# EAGLE design FubarinoMini_v16 (EAGLE 6.4)
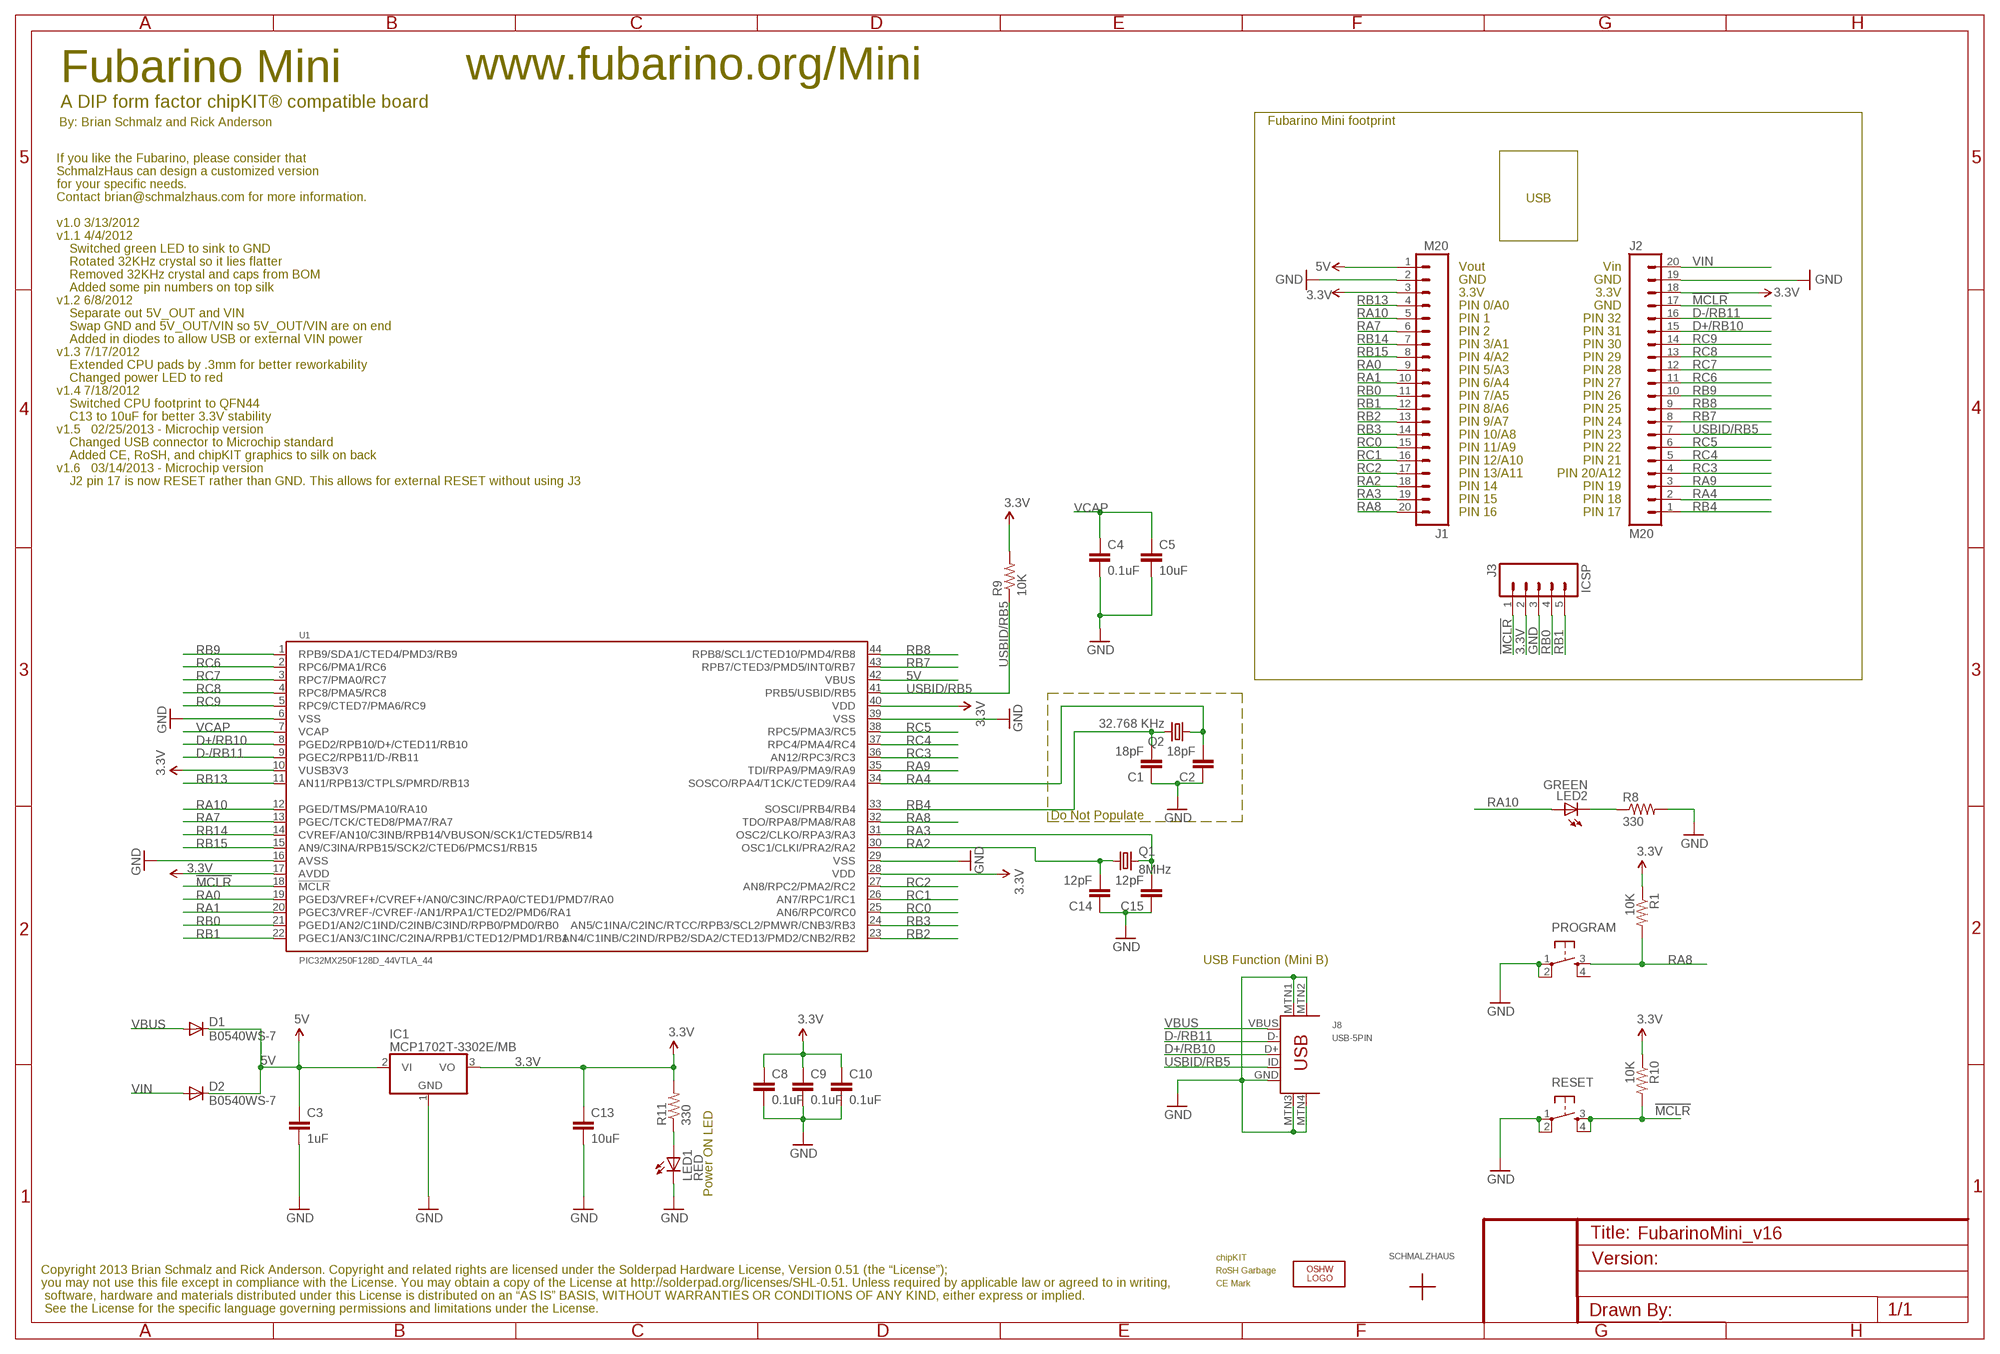
[diagram p0: schematic, sheet 1]

## Parts
C1  18pF  CAP0603-CAP  [0603-CAP]
C2  18pF  CAP0603-CAP  [0603-CAP]
C3  1uF  CAP0603-CAP  [0603-CAP]
C4  0.1uF  CAP0603-CAP  [0603-CAP]
C5  10uF  CAP0805  [0805]
C8  0.1uF  CAP0603-CAP  [0603-CAP]
C9  0.1uF  CAP0603-CAP  [0603-CAP]
C10  0.1uF  CAP0603  [0603]
C13  10uF  CAP0805  [0805]
C14  12pF  CAP0603-CAP  [0603-CAP]
C15  12pF  CAP0603-CAP  [0603-CAP]
D1  B0540WS-7  DIODESOD  [SOD-323]
D2  B0540WS-7  DIODESOD  [SOD-323]
IC1  MCP1702T-3302E/MB  MCP170333MB  [SOT89]
ICSP  J3  M05NOSLILK  [1X05_NOSILK]
J1  M20  [1X20_NO_PIN1]
J2  M20  [1X20_NO_PIN1]
J8  USB-5PIN  [USB-MINIB-5PIN-HIROSE-UX60-MB-5ST]
LED1  RED  LED0603  [LED-0603]
LED2  GREEN  LED0603  [LED-0603]
LOGO1  OSHW_LOGO_8MILX0070-NT  [OSHW_8X70_NOTEXT]
PROGRAM  TAC_SWITCHSND  [TACTILE_SWITCH_SMD]
Q1  8MHz  CRYSTALNX5032  [NX5032_5MM_3.2MM_CRYSTAL]
Q2  32.768 KHz  CRYSTALTC26H  [TC26H]
R1  10K  RESISTOR0603-RES  [0603-RES]
R8  330  RESISTOR0603-RES  [0603-RES]
R9  10K  RESISTOR0603-RES  [0603-RES]
R10  10K  RESISTOR0603-RES  [0603-RES]
R11  330  RESISTOR0603-RES  [0603-RES]
RESET  TAC_SWITCHSND  [TACTILE_SWITCH_SMD]
U1  PIC32MX250F128D_44VTLA_44  PIC32MX2XX_44QFN44  [QFN-44-8X8-NOPAD]
U$1  SCHMALZHAUSSCHMALZHAUS_SMALL  [SCHMALZHAUS_SMALL]
U$2  CE_MARK5MM  [CE_5MM]
U$3  ROSH_GARBAGE  [ROHS_GARBAGE_5MM]
U$4  CHIPKIT2MM  [CHIPKIT_2MM]

## Nets
3.3V: C8.1 C9.1 C10.1 C13.1 IC1.3(VO) ICSP.2 J1.3 J2.18 R1.1 R9.2 R10.1 R11.2 U1.10(VUSB3V3) U1.17(AVDD) U1.28(VDD) U1.40(VDD)
5V: C3.1 D1.1(C) D2.1(C) IC1.2(VI) IC1.2@1(VI1) J1.1 U1.42(VBUS)
!MCLR!: ICSP.1 J2.17 R10.2 RESET.3 RESET.4 U1.18(!MCLR!)
D+/RB10: J2.15 J8.D+ U1.8(PGED2/RPB10/D+/CTED11/RB10)
D-/RB11: J2.16 J8.D- U1.9(PGEC2/RPB11/D-/RB11)
GND: C1.1 C2.1 C3.2 C4.2 C5.2 C8.2 C9.2 C10.2 C13.2 C14.1 C15.1 IC1.1(GND) ICSP.3 J1.2 J2.19 J8.GND J8.MTN1 J8.MTN2 J8.MTN3 J8.MTN4 LED1.C PROGRAM.1 PROGRAM.2 R8.2 RESET.1 RESET.2 U1.6(VSS) U1.16(AVSS) U1.29(VSS) U1.39(VSS)
N$6: LED1.A R11.1
N$20: LED2.C R8.1
RA0: J1.9 U1.19(PGED3/VREF+/CVREF+/AN0/C3INC/RPA0/CTED1/PMD7/RA0)
RA1: J1.10 U1.20(PGEC3/VREF-/CVREF-/AN1/RPA1/CTED2/PMD6/RA1)
RA2: C14.2 J1.18 Q1.1 U1.30(OSC1/CLKI/PRA2/RA2)
RA3: C15.2 J1.19 Q1.2 U1.31(OSC2/CLKO/RPA3/RA3)
RA4: C2.2 J2.2 Q2.1 U1.34(SOSCO/RPA4/T1CK/CTED9/RA4)
RA7: J1.6 U1.13(PGEC/TCK/CTED8/PMA7/RA7)
RA8: J1.20 PROGRAM.3 R1.2 U1.32(TDO/RPA8/PMA8/RA8)
RA9: J2.3 U1.35(TDI/RPA9/PMA9/RA9)
RA10: J1.5 LED2.A U1.12(PGED/TMS/PMA10/RA10)
RB0: ICSP.4 J1.11 U1.21(PGED1/AN2/C1IND/C2INB/C3IND/RPB0/PMD0/RB0)
RB1: ICSP.5 J1.12 U1.22(PGEC1/AN3/C1INC/C2INA/RPB1/CTED12/PMD1/RB1)
RB2: J1.13 U1.23(AN4/C1INB/C2IND/RPB2/SDA2/CTED13/PMD2/CNB2/RB2)
RB3: J1.14 U1.24(AN5/C1INA/C2INC/RTCC/RPB3/SCL2/PMWR/CNB3/RB3)
RB4: C1.2 J2.1 Q2.2 U1.33(SOSCI/PRB4/RB4)
RB7: J2.8 U1.43(RPB7/CTED3/PMD5/INT0/RB7)
RB8: J2.9 U1.44(RPB8/SCL1/CTED10/PMD4/RB8)
RB9: J2.10 U1.1(RPB9/SDA1/CTED4/PMD3/RB9)
RB13: J1.4 U1.11(AN11/RPB13/CTPLS/PMRD/RB13)
RB14: J1.7 U1.14(CVREF/AN10/C3INB/RPB14/VBUSON/SCK1/CTED5/RB14)
RB15: J1.8 U1.15(AN9/C3INA/RPB15/SCK2/CTED6/PMCS1/RB15)
RC0: J1.15 U1.25(AN6/RPC0/RC0)
RC1: J1.16 U1.26(AN7/RPC1/RC1)
RC2: J1.17 U1.27(AN8/RPC2/PMA2/RC2)
RC3: J2.4 U1.36(AN12/RPC3/RC3)
RC4: J2.5 U1.37(RPC4/PMA4/RC4)
RC5: J2.6 U1.38(RPC5/PMA3/RC5)
RC6: J2.11 U1.2(RPC6/PMA1/RC6)
RC7: J2.12 U1.3(RPC7/PMA0/RC7)
RC8: J2.13 U1.4(RPC8/PMA5/RC8)
RC9: J2.14 U1.5(RPC9/CTED7/PMA6/RC9)
USBID/RB5: J2.7 J8.ID R9.1 U1.41(PRB5/USBID/RB5)
VBUS: D1.2(A) J8.VBUS
VCAP: C4.1 C5.1 U1.7(VCAP)
VIN: D2.2(A) J2.20
Unconnected: PROGRAM.4

## Notes on the sheet
- Fubarino Mini | www.fubarino.org/Mini
- A DIP form factor chipKIT® compatible board
- By: Brian Schmalz and Rick Anderson | Fubarino Mini footprint
- If you like the Fubarino, please consider that
- SchmalzHaus can design a customized version
- for your specific needs.
- Contact brian@schmalzhaus.com for more information. | USB
- v1.0 3/13/2012
- v1.1 4/4/2012
- Switched green LED to sink to GND
- Vin
- Rotated 32KHz crystal so it lies flatter
- Vout
- GND
- Removed 32KHz crystal and caps from BOM
- GND
- 3.3V
- Added some pin numbers on top silk
- 3.3V
- GND
- v1.2 6/8/2012
- PIN 0/A0
- PIN 32
- Separate out 5V_OUT and VIN
- PIN 1
- PIN 31
- Swap GND and 5V_OUT/VIN so 5V_OUT/VIN are on end
- PIN 2
- PIN 30
- Added in diodes to allow USB or external VIN power
- PIN 3/A1
- PIN 29
- v1.3 7/17/2012
- PIN 4/A2
- PIN 28
- Extended CPU pads by .3mm for better reworkability
- PIN 5/A3
- PIN 27
- Changed power LED to red
- PIN 6/A4
- PIN 26
- v1.4 7/18/2012
- PIN 7/A5
- PIN 25
- Switched CPU footprint to QFN44
- PIN 8/A6
- PIN 24
- C13 to 10uF for better 3.3V stability
- PIN 9/A7
- PIN 23
- v1.5   02/25/2013 - Microchip version
- PIN 10/A8
- PIN 22
- Changed USB connector to Microchip standard
- PIN 11/A9
- PIN 21
- Added CE, RoSH, and chipKIT graphics to silk on back
- PIN 12/A10
- PIN 20/A12
- v1.6   03/14/2013 - Microchip version
- PIN 13/A11
- PIN 19
- J2 pin 17 is now RESET rather than GND. This allows for external RESET without using J3
- PIN 14
- PIN 18
- PIN 15
- PIN 17
- PIN 16
- Do Not Populate
- USB Function (Mini B)
- Power ON LED
- Copyright 2013 Brian Schmalz and Rick Anderson. Copyright and related rights are licensed under the Solderpad Hardware License, Version 0.51 (the “License”);
- you may not use this file except in compliance with the License. You may obtain a copy of the License at http://solderpad.org/licenses/SHL-0.51. Unless required by applicable law or agreed to in writing,
- software, hardware and materials distributed under this License is distributed on an “AS IS” BASIS, WITHOUT WARRANTIES OR CONDITIONS OF ANY KIND, either express or implied.
- See the License for the specific language governing permissions and limitations under the License.

## Library data of the parts
C1-C4 C8 C9 C14 C15 = SparkFun:CAP: Capacitor Standard 0603 ceramic capacitor, and 0.1" leaded capacitor.
C5 = SchmalzHaus:CAP: Capacitor Standard 0603 ceramic capacitor, and 0.1" leaded capacitor.
C10 C13 = SparkFun02-20-08:CAP: Capacitor Standard 0603 ceramic capacitor, and 0.1" leaded capacitor.
D1 D2 = SparkFun:DIODE: Diode These are standard reverse protection diodes and small signal diodes. SMA package can handle up to about 1A. SOD-323 can handle about 200mA. What the SOD-323 package when ordering, there are some mfgs out there that are 5-pin packages.
IC1 = linear:MCP1703*: 250 mA, 16V, Low Quiescent Current LDO Regulator Source: http://ww1.microchip.com/downloads/en/DeviceDoc/22049b.pdf
ICSP = SchmalzHaus:M05: Header 5 Standard 5-pin 0.1" header. Use with straight break away headers (SKU : PRT-00116), right angle break away headers (PRT-00553), swiss pins (PRT-00743), machine pins (PRT-00117), and female headers (PRT-00115). Molex polarized connector foot print use with SKU : PRT-08230 with associated crimp pins and housings.
J1 J2 = SchmalzHaus:M20
J8 = SchmalzHaus:USB-5PIN
LED1 LED2 = SparkFun:LED: LEDs Standard schematic elements and footprints for 5mm, 3mm, 1206, and 0603 sized LEDs. 5mm - Spark Fun Electronics SKU : COM-00529 (and others)
LOGO1 = OSHW:OSHW_LOGO_8MIL
PROGRAM RESET = SparkFun02-20-08:TAC_SWITCH: Momentary Switch Button commonly used for reset or general input. Spark Fun Electronics SKU : COM-00097
Q1 Q2 = SchmalzHaus:CRYSTAL: Crystals Various standard crystals. Proven footprints. Spark Fun Electronics SKU : COM-00534
R1 R8-R11 = SparkFun:RESISTOR: Resistor Basic schematic elements and footprints for 0603, 1206, and PTH resistors.
U1 = SchmalzHaus:PIC32MX2XX_44
U$1 = SchmalzHaus:SCHMALZHAUS
U$2 = SchmalzHausPublic:CE_MARK
U$3 = SchmalzHausPublic:ROSH_GARBAGE
U$4 = SchmalzHausPublic:CHIPKIT

## Board
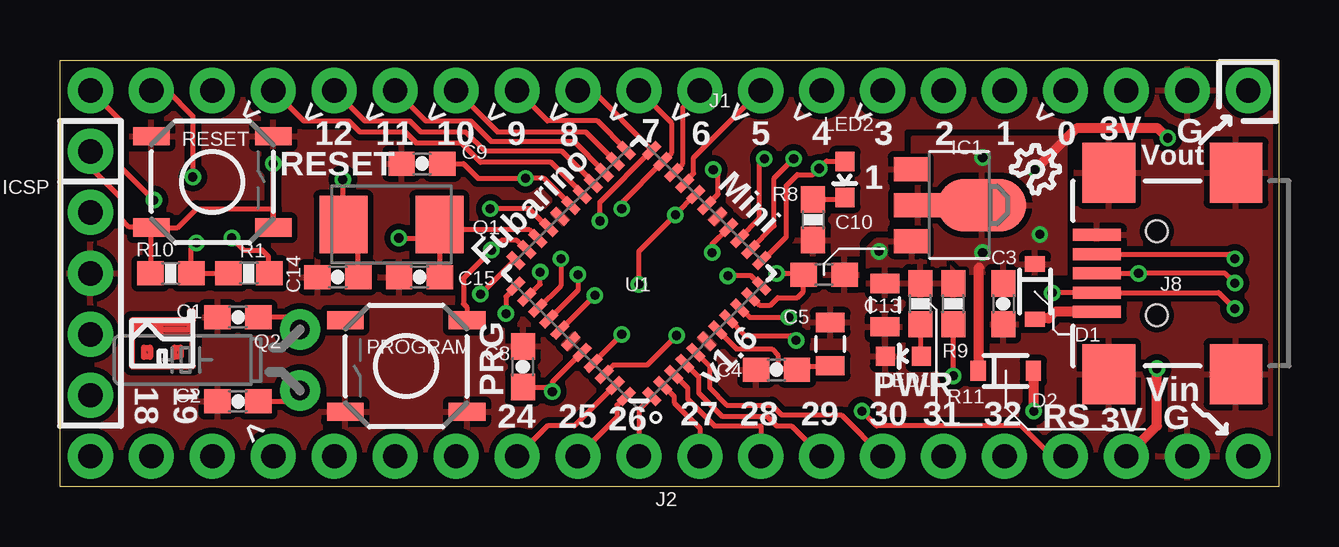
[diagram p1: board, top side]
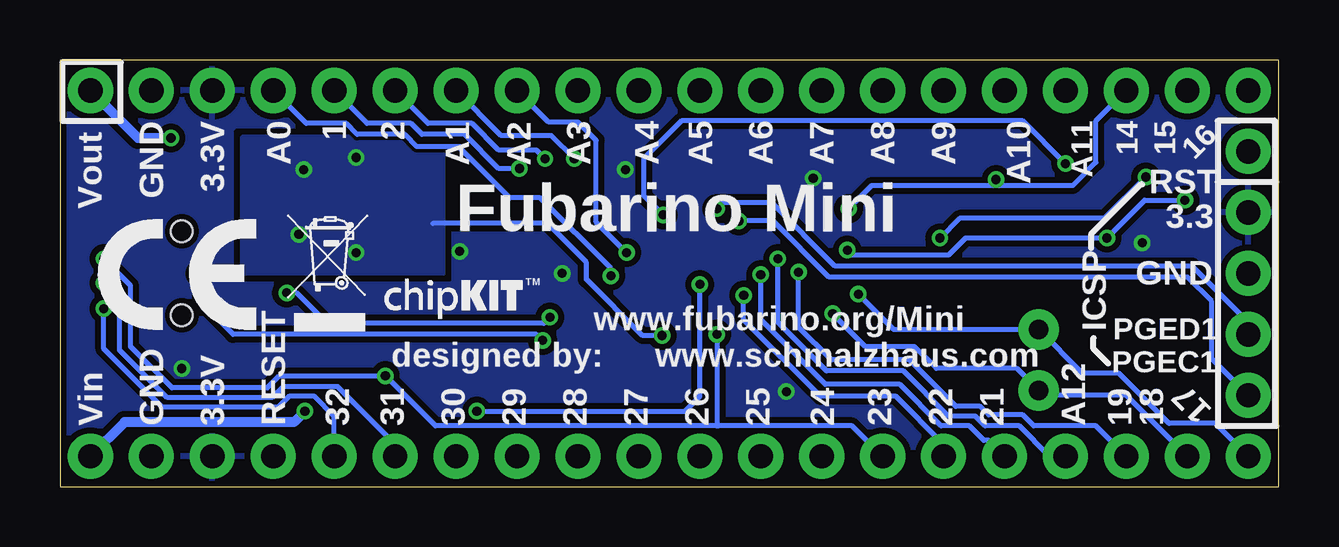
[diagram p2: board, bottom side, seen from below]

Size 50.8 x 17.78 mm. Coordinates in mm from the lower left corner, seen from the top.
Outline: 0,17.78 50.8,17.78 50.8,0 0,0 0,17.78
Copper layers (1*16): Top 0.035mm / dielectric 1.5mm / Bottom 0.035mm
Design rules "Fusion_eagle_rule_v1.1": minimum track width 6mil, minimum drill 12mil, track to track 6mil, track to pad 6mil, pad to pad 6mil, via to via 6mil, smd to smd 0mil, copper to edge 10mil, drill to drill 10mil, minimum pad ring 10mil, minimum via ring 6mil, stop-mask expansion 2mil, vias tented up to drill 100mil, thermal gap 10mil

### Footprints (pad centres in the part's own frame; a part is rotated, then mirrored left to right if it is on the bottom)
0603-CAP = smd 1.1 x 1: 1 -0.85,0; 2 0.85,0
0805 = smd 0.8 x 1.2: 1 -0.9,0; 2 0.9,0
0603 = smd 1.1 x 1: 1 -0.85,0; 2 0.85,0
SOD-323 = smd 0.63 x 0.83: 1 -1.15,0; 2 1.15,0
SOT89 = smd 1 x 1.5: 1 -1.499,-1.981; 3 1.499,-1.981 | smd 1 x 2: 2 0,-1.727 | smd 2.2 x 3.7: 2@1 0,0.94
1X05_NOSILK = drill 1.016 pad 1.88: 1 0,0; 2 2.54,0; 3 5.08,0; 4 7.62,0; 5 10.16,0
1X20_NO_PIN1 = drill 1.016 pad 1.88: 1 -24.13,0; 2 -21.59,0; 3 -19.05,0; 4 -16.51,0; 5 -13.97,0; 6 -11.43,0; 7 -8.89,0; 8 -6.35,0; 9 -3.81,0; 10 -1.27,0; 11 1.27,0; 12 3.81,0; 13 6.35,0; 14 8.89,0; 15 11.43,0; 16 13.97,0; 17 16.51,0; 18 19.05,0; 19 21.59,0; 20 24.13,0
USB-MINIB-5PIN-HIROSE-UX60-MB-5ST = smd 0.5 x 2: D+ 0,2.5; D- -0.8,2.5; GND 1.6,2.5; ID 0.8,2.5; VBUS -1.6,2.5 | smd 2.5 x 2.2: MTN1 -4.2,-3.3; MTN2 -4.2,2; MTN3 4.2,-3.3; MTN4 4.2,2 | hole 0.9: -1.75,0; 1.75,0
LED-0603 = smd 0.8 x 0.8: A 0,-0.75; C 0,0.75
TACTILE_SWITCH_SMD = smd 1.524 x 0.762: 1 -2.54,1.905; 2 2.54,1.905; 3 -2.54,-1.905; 4 2.54,-1.905
NX5032_5MM_3.2MM_CRYSTAL = smd 2 x 2.4: 1 -2,0; 2 2,0
TC26H = drill 0.813 pad 1.676: 1 -1.27,0; 2 1.27,0
0603-RES = smd 1.1 x 1: 1 -0.85,0; 2 0.85,0
QFN-44-8X8-NOPAD = smd 0.8 x 0.35: 1 -4,3.25; 2 -4,2.6; 3 -4,1.95; 4 -4,1.3; 5 -4,0.65; 6 -4,0; 7 -4,-0.65; 8 -4,-1.3; 9 -4,-1.95; 10 -4,-2.6; 11 -4,-3.25; 23 4,-3.25; 24 4,-2.6; 25 4,-1.95; 26 4,-1.3; 27 4,-0.65; 28 4,0; 29 4,0.65; 30 4,1.3; 31 4,1.95; 32 4,2.6; 33 4,3.25 | smd 0.35 x 0.8: 12 -3.25,-4; 13 -2.6,-4; 14 -1.95,-4; 15 -1.3,-4; 16 -0.65,-4; 17 0,-4; 18 0.65,-4; 19 1.3,-4; 20 1.95,-4; 21 2.6,-4; 22 3.25,-4; 34 3.25,4; 35 2.6,4; 36 1.95,4; 37 1.3,4; 38 0.65,4; 39 0,4; 40 -0.65,4; 41 -1.3,4; 42 -1.95,4; 43 -2.6,4; 44 -3.25,4

### Placement (x,y rotation side)
C1  7.42,7.06 0 top
C2  7.42,3.56 0 top
C3  39.32,7.62 270 top
C4  29.87,4.88 180 top
C5  32.11,5.94 90 top
C8  19.3,5 90 top
C9  15.09,13.46 180 top
C10  31.85,8.84 0 top
C13  34.39,7.57 270 top
C14  11.58,8.74 0 top
C15  14.99,8.74 0 top
D1  40.64,8.13 270 top
D2  39.42,4.83 0 top
DRILEGEND  [DRILEGEND]  101.19,28.7 0 top  (outside the outline)
IC1  37.49,11.73 270 top
ICSP  1.27,13.97 270 top
J1  25.4,16.51 180 top
J2  25.4,1.27 0 top
J8  45.72,8.89 90 top
LED1  35.15,5.44 90 top
LED2  32.72,12.8 180 top
LOGO1  39.41,13.38 315 top
PROGRAM  14.43,5.03 180 top
Q1  13.82,10.92 0 top
Q2  10.01,5.28 90 top
R1  7.87,8.89 0 top
R8  31.39,11.13 270 top
R9  37.24,7.62 90 top
R10  4.62,8.89 180 top
R11  35.86,7.62 90 top
RESET  6.35,12.7 0 top
U1  24.13,8.89 135 top
U$1  4.27,5.03 0 top
U$2  45.9,8.9 0 bottom
U$3  41.3,6.49 0 bottom
U$4  37.39,6.94 0 bottom

### Tracks (layer width: path | path; a pad name or v marks a point on that pad's centre or on a via)
3.3V  (via drill 0.38)
  Top 0.203: 5.44,8.85 R10.1 | R10.1 R1.1 | C9.1 16.82,13.46 17.42,12.85 v19.41,12.85 20.17,12.85 U1.28 | U1.10 28.83,7.9 29.16,7.57 29.62,7.57 29.92,7.87 30.73,7.87 30.99,8.13 30.99,8.83 C10.1 30.95,8.89 v29.87,8.89 | R10.1 5.47,9.94 v5.69,10.16 | U1.40 20.52,4.37 v20.52,3.96 20.34,4.15 C8.1 | U1.17 27.43,12.19 27.43,13.01 v27.23,13.21
  Top 0.406: J2.18 45.72,2.54 v45.72,4.93
  other vias: 34.14,9.8
  pour Bottom (isolate 0.254, rank 3): 0,0 0,17.78 50.8,17.78 50.8,0
  pour Top: 34.04,10.26 33.68,9.91 33.68,7.98 37.29,7.98 37.29,8.94 36.93,9.3 36.12,9.3 35.86,9.55 35.86,9.86 35.46,10.26
5V  (via drill 0.38)
  Top 0.203: U1.42 22.68,4.7 23.06,5.08 24.49,5.08 v25.7,6.3
  Top 0.406: 38.3,9.14 38.3,4.79 D2.1 | v46.18,14.53 45.77,14.94 42.37,14.94 v40.64,13.21
  Bottom 0.203: 35.26,10.97 30.48,10.97 28.85,9.35 28.85,8.64 26.52,6.3 v25.7,6.3
  Bottom 0.406: v46.18,14.53 47.55,14.53 J1.1
  other vias: 40.84,10.52 38.46,13.72 38.46,9.75
  pour Top (rank 3): 35.61,8.94 41.91,8.89 41.91,14.53 35.56,14.53
  pour Bottom: 34.85,14.58 34.85,8.89 43.18,8.89 43.18,14.58
!MCLR!  (via drill 0.38)
  Top 0.203: RESET.3 4.9,10.79 5.69,11.58 8.89,11.58 RESET.4 v8.89,13.46 | RESET.3 3.81,8.93 R10.2 | ICSP.1 1.27,13.31 2.54,12.04 2.54,11.18 2.9,10.82 3.79,10.82 RESET.3 | U1.18 v25.65,11.33 24.13,9.8 v24.13,8.43 | J2.17 41.35,1.27 40.08,2.54 34.04,2.54 v33.43,3.15
  Bottom 0.203: v8.89,13.46 10.67,15.24 24.89,15.24 26.47,13.66 26.47,12.14 v25.65,11.33 | v33.43,3.15 24.74,3.15 24.13,3.76 v24.13,8.43
D+/RB10  (via drill 0.38)
  Top 0.203: v48.97,8.48 48.56,8.89 v44.96,8.89 J8.D+ | U1.8 28.55,6.3 30.48,6.3 v30.68,6.1
  Bottom 0.203: J2.15 36.83,1.78 39.22,4.17 41.5,4.17 41.96,3.71 46.33,3.71 48.31,5.69 48.31,7.82 v48.97,8.48 | v30.68,6.1 30.94,6.35 43.59,6.35 44.96,7.72 v44.96,8.89
D-/RB11  (via drill 0.38)
  Top 0.203: U1.9 28.37,7.44 28.75,7.06 v30.38,7.06 | 48.72,7.67 v48.97,7.42 48.3,8.09 J8.D- 41.36,8.09 v41.35,8.08
  Bottom 0.203: J2.16 39.37,2.95 40.18,3.76 41.25,3.76 41.71,3.3 46.53,3.3 48.97,5.74 v48.97,7.42 | v30.38,7.06 30.63,6.81 39.67,6.81 40.95,8.08 v41.35,8.08
GND
  pour Top (isolate 0.254, rank 6): 0,17.78 0,0 50.8,0 50.8,17.78
N$6
  Top 0.203: R11.1 35.87,5.47 LED1.A
N$20
  Top 0.203: R8.1 32.64,11.97 LED2.C
RA0
  Top 0.203: U1.19 26.04,12.68 26.42,13.06 26.42,13.72 J1.9
RA1
  Top 0.203: U1.20 25.59,13.1 25.96,13.46 25.96,15.8 J1.10
RA2  (via drill 0.38)
  Top 0.203: v11.79,12.8 11.79,10.89 | C14.2 12.43,10.31 Q1.1 11.79,10.89 | 11.79,10.87 11.79,10.89 | U1.30 20.33,10.81 19.56,11.58 v17.93,11.58
  Bottom 0.203: 11.8,12.55 8.59,12.55 7.62,13.51 7.62,15.24 J1.18 | 11.8,12.55 16.97,12.55 v17.93,11.58 | 11.8,12.55 11.8,12.79 v11.79,12.8
RA3  (via drill 0.38)
  Top 0.203: v14.12,10.36 15.34,10.36 15.7,10.72 15.7,10.8 Q1.2 | v5.54,12.9 5.54,15.44 4.47,16.51 J1.19 | Q1.2 15.82,8.76 C15.2 | Q1.2 16.02,10.72 19.54,10.72 U1.31
  Bottom 0.203: v14.12,10.36 13.31,11.18 7.26,11.18 v5.54,12.9
RA4  (via drill 0.38)
  Top 0.203: C2.2 9.55,3.56 Q2.1 | U1.34 19,8.34 18.59,7.92 v18.59,7.21
  Bottom 0.203: J2.2 6.35,3.81 9.8,3.81 Q2.1 10.92,4.93 14.28,4.93 15.19,5.84 17.22,5.84 v18.59,7.21
RA7  (via drill 0.38)
  Top 0.203: U1.13 28.8,9.9 29.77,10.87 29.77,12.85 v30.58,13.66
  Bottom 0.203: v30.58,13.66 30.94,14.02 32.51,14.02 33.63,15.14 35.46,15.14 J1.6
RA8  (via drill 0.38)
  Top 0.203: v3.91,11.94 2.54,13.31 2.54,15.24 J1.20 | v7.16,10.36 7.67,9.86 8.43,9.86 8.69,9.6 8.69,8.93 R1.2 | U1.32 19.43,9.88 19.05,10.26 18.39,10.26 v17.98,9.86 16.82,8.69 16.82,7.62 16.97,7.47 PROGRAM.3
  Bottom 0.203: v3.91,11.94 5.59,11.94 v7.16,10.36 13.06,10.36 13.77,9.65 17.78,9.65 v17.98,9.86
RA9  (via drill 0.38)
  Top 0.203: U1.35 19.48,7.9 20.02,8.43 v20.02,8.94
  Bottom 0.203: J2.3 7.62,2.54 10.21,2.54 10.67,3 12.09,3 12.45,3.35 13.46,3.35 15.39,5.28 18.64,5.28 20.02,6.66 v20.02,8.94
RA10  (via drill 0.38)
  Top 0.203: U1.12 29.28,9.42 30.28,10.41 30.28,12.55 30.73,13.01 31.39,13.01 v31.65,13.26 31.95,13.56 32.7,13.56 LED2.A
  Bottom 0.203: v31.65,13.26 32.51,13.26 33.93,14.68 35.71,14.68 36.17,15.14 38,15.14 J1.5
RB0  (via drill 0.38)
  Top 0.203: J1.11 25.5,15.14 25.5,13.92 25.14,13.56 U1.21 25.12,13.54 23.42,11.84 v23.42,11.58
  Bottom 0.203: ICSP.4 1.27,6.86 3.61,9.2 18.49,9.2 21.13,11.84 23.16,11.84 v23.42,11.58
RB1  (via drill 0.38)
  Top 0.203: J1.12 22.2,16.51 24.66,14.05 U1.22 22.5,11.86 v22.5,11.07
  Bottom 0.203: ICSP.5 2.79,5.33 2.79,7.72 3.81,8.74 18.75,8.74 21.08,11.07 v22.5,11.07
RB2
  Top 0.203: U1.23 23.6,14.04 22.4,15.24 20.32,15.24 J1.13
RB3
  Top 0.203: J1.14 18.24,14.78 21.91,14.78 U1.24
RB4  (via drill 0.38)
  Top 0.203: C1.2 9.5,7.06 Q2.2 | U1.33 18.92,9.42 v17.53,8.03
  Bottom 0.203: J2.1 2.64,2.64 4.57,2.64 6.66,4.72 8.18,4.72 Q2.2 16.05,6.55 v17.53,8.03
RB7
  Top 0.203: U1.43 23.14,4.19 23.09,4.19 21.44,2.54 20.32,2.54 J2.8
RB8
  Top 0.203: J2.9 23.22,2.9 23.22,3.4 23.49,3.68 23.6,3.68 U1.44
RB9
  Top 0.203: U1.1 24.68,3.76 24.68,3.75 24.13,3.2 J2.10
RB13  (via drill 0.38)
  Top 0.203: U1.11 29.23,8.36 28.8,8.79 v27.84,8.79
  Bottom 0.203: J1.4 40.54,15.14 38.86,15.14 38.41,14.68 36.42,14.68 35.92,14.17 34.14,14.17 34.14,14.12 32.05,12.04 30.79,12.04 27.84,9.09 v27.84,8.79
RB14  (via drill 0.38)
  Top 0.203: U1.14 28.34,10.35 29.16,11.18 29.16,13.46 v29.36,13.66
  Bottom 0.203: v29.36,13.66 30.33,14.63 32.41,14.63 J1.7
RB15  (via drill 0.38)
  Top 0.203: v27.18,9.75 27.18,10.11 27.48,10.41 27.49,10.41 U1.15
  Bottom 0.203: v27.18,9.75 28.45,11.02 28.45,14.43 29.21,15.19 30.43,15.19 J1.8
RC0
  Top 0.203: J1.15 15.24,15.24 17.12,15.24 17.98,14.38 21.44,14.38 22.68,13.13 U1.25
RC1
  Top 0.203: J1.16 12.7,15.24 14.58,15.24 15.04,14.78 16.92,14.78 17.73,13.97 20.93,13.97 22.22,12.68 U1.26
RC2
  Top 0.203: J1.17 10.16,15.24 12.04,15.24 12.5,14.78 14.38,14.78 14.83,14.33 16.71,14.33 17.53,13.51 20.47,13.51 21.76,12.22 U1.27
RC3  (via drill 0.38)
  Top 0.203: v20.88,9.5 20.88,8.38 19.94,7.44 U1.36
  Bottom 0.203: J2.4 9.55,1.27 10.82,2.54 12.24,2.54 12.65,2.95 13.77,2.95 15.65,4.83 18.85,4.83 20.88,6.86 v20.88,9.5
RC4  (via drill 0.38)
  Top 0.203: v21.59,8.84 21.59,8.18 20.39,6.98 U1.37
  Bottom 0.203: J2.5 12.09,1.93 12.29,1.93 12.9,2.54 14.07,2.54 15.8,4.27 18.9,4.27 21.59,6.96 v21.59,8.84
RC5  (via drill 0.38)
  Top 0.203: U1.38 v22.3,7.98
  Bottom 0.203: v22.3,7.98 22.3,6.96 19.1,3.76 15.95,3.76 13.97,1.78 J2.6
RC6
  Top 0.203: U1.2 25.14,4.22 25.6,3.76 25.6,3.5 26.67,2.44 J2.11
RC7
  Top 0.203: J2.12 29.21,2.54 27.28,2.54 26.16,3.66 26.16,4.12 25.59,4.68 U1.3
RC8
  Top 0.203: J2.13 30.48,2.54 29.87,2.54 29.46,2.95 27.58,2.95 26.62,3.91 26.62,4.57 U1.4
RC9
  Top 0.203: J2.14 32.56,3 30.07,3 29.67,3.4 27.79,3.4 27.08,4.12 27.08,5.03 U1.5
USBID/RB5  (via drill 0.38)
  Top 0.203: v37.24,4.62 R9.1 | U1.41 22.22,5.15 v23.42,6.35 | v48.97,9.5 48.78,9.69 J8.ID
  Bottom 0.203: J2.7 17.78,2.54 23.37,2.54 23.42,2.54 | 23.42,2.54 35.15,2.54 v37.24,4.62 41.66,4.62 42.16,4.12 46.13,4.12 47.85,5.84 47.85,8.38 v48.97,9.5 | v23.42,6.35 23.42,2.54
VBUS
  Top 0.406: D1.2 40.67,7.01 41.2,7.01 41.48,7.29 J8.VBUS
VCAP
  Top 0.203: U1.7 28.19,5.74 29.67,5.74 29.92,5.49 29.92,5.08 30.07,4.93 30.52,4.93 30.53,4.94 | 30.23,4.94 30.53,4.94 | 30.66,4.94 31.1,4.94 31.19,5.03 32.09,5.03 C5.1 | 30.53,4.94 30.66,4.94 | 30.66,4.94 C4.1
VIN  (via drill 0.38)
  Top 0.203: v40.59,3.15 40.57,3.17
  Top 0.406: D2.2 40.57,3.17
  Bottom 0.406: J2.20 48.11,2.69 41.05,2.69 v40.59,3.15

### Text on the board
tPlace: ^ | ^ | ^ | ^ | ^ | ^ | ^ | ^ | ^ | ^ | ^ | ^ | 12 | 11 | 10 | 9 | 8 | 7 | 6 | 5 | 4 | 3 | 2 | 1 | 0 | 3V | G | RESET | Mini | Vout | 1 | Fubarino | 18 | 19 | PRG | v1.6 | PWR | Vin | 27 | 28 | 29 | 30 | 31 | 32 | ^ | 24 | 25 | 26 | RS | 3V | G
bPlace: 16 | 15 | 14 | A11 | A10 | A9 | A8 | A7 | A6 | A5 | A4 | A3 | A2 | A1 | 2 | 1 | A0 | 3.3V | GND | Vout | RST | 3.3 | Fubarino Mini | ICSP | GND | PGED1 | www.fubarino.org/Mini | PGEC1 | www.schmalzhaus.com | designed by: | 17 | 18 | 19 | A12 | 21 | 22 | 23 | 24 | 25 | 26 | 27 | 28 | 29 | 30 | 31 | 32 | RESET | 3.3V | GND | Vin
tDocu: ASSEMBLY NOTES: UNLESS OTHERWISE SPECIFIED / 1. ALL COMONENTS ARE RoHS COMPLIANT. / 2. ALL THROUGH HOLE COMPONENTS MOUNTED ON THE TOP SIDE / 3. ALL COMPONENTS AHLL BE MOUNTED FLUSH TO THE BOARD / 4. ALL UNUSED COMPONENTS PADS SHALL BE FREE OF SOLDER / 5. ALL LEADS SHALL BE TRIMMED TO A MAXIMUM LENGTH OF : N/A / 6. MAXIMUM COMPONENT HEIGHT NOT TO EXEED: N/A / 7. THESE COMPONENTS REQUIRE SOCKETS: NONE. / 8. UNPOPULATED COMPONENTS: SEE BILL OF MATERIALS / 9. FINISHED BOARD SHALL BE FREE FO ALL RESIDUES | TITLE: FUBARINO MINI / VERSION: 1.6 / DATE: 3/14/2013 / PCB DESIGNER: BRIAN SCHMALZ / ENGINEER: BRIAN SCHMALZ
tMap: Copyright 2012 Brian Schmalz Copyright and related rights are licensed under the Solderpad Hardware License, Version 0.51 (the “License”); | you may not use this file except in compliance with the License. You may obtain a copy of the License at http://solderpad.org/licenses/SHL-0.51. Unless required by applicable law or agreed to in writing, | software, hardware and materials distributed under this License is distributed on an “AS IS” BASIS, WITHOUT WARRANTIES OR CONDITIONS OF ANY KIND, either express or implied. | See the License for the specific language governing permissions and limitations under the License.
DrillLegend: LAYER-STACK
DrillLegend_01-16: 01-16
DrillLegend_01-20: 01-20
Contour: Notes: / This PCB to be manufactued to meet all acceptance levels / of a CLASS 2 PCB per ANSI/IPC-A-600G. / Material: Isola PCL370HR FR-4 or equivalent. / Multilayer / 2 Layers / Controlled Impedance / Cu weight external layers : 1oz / Cu weight internal layers : / Finished overall thickenss : 0.062 / Finish: / Immersion Gold / X Immersion Tin / Soldermask over bare copper (SMOBC) with / Hot-Air-Leveled-Solder / If edge connector fingers are present, plate / with Nicel/Gold >= 20 microinches Gold / / Soldermask: Dynachem EPIC 200 LPI or equivalent. / Soldermask Color: Green / Silkscreen Color: White / / Artwork Set No. 04-10134 Rev 1.6 / / All holes to be located by the NC Drill File. / Indicate Country where PCB was fabricated on the / side indicated. / Any devication from the above specs must be approved / by Schmalz Haus LLC.